# Altium schematic sheet Top level overview.SchDoc
size A4
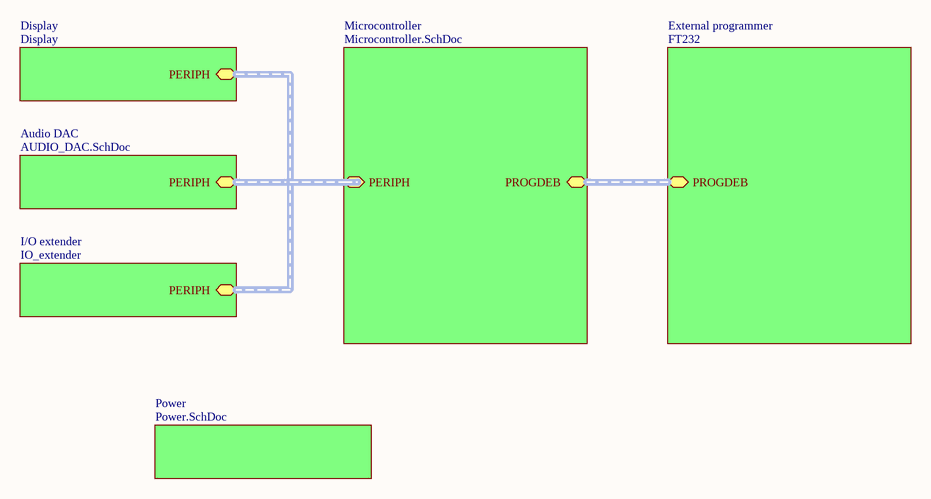
[diagram p0: Top level overview.SchDoc]

## Sub-sheets
Audio DAC = AUDIO_DAC.SchDoc: PERIPH (harness PERIPH)
Display = Display: PERIPH (harness PERIPH)
External programmer = FT232: PROGDEB (harness PROGDEB)
I/O extender = IO_extender: PERIPH (harness PERIPH)
Microcontroller = Microcontroller.SchDoc: PROGDEB (harness PROGDEB), PERIPH (harness PERIPH)
Power = Power.SchDoc: no entries

## Buses and harness runs
harness sheet Audio DAC/PERIPH = sheet Display/PERIPH = sheet I/O extender/PERIPH = sheet Microcontroller/PERIPH
harness sheet External programmer/PROGDEB = sheet Microcontroller/PROGDEB